# EAGLE design LM386 basic (EAGLE 6.4)
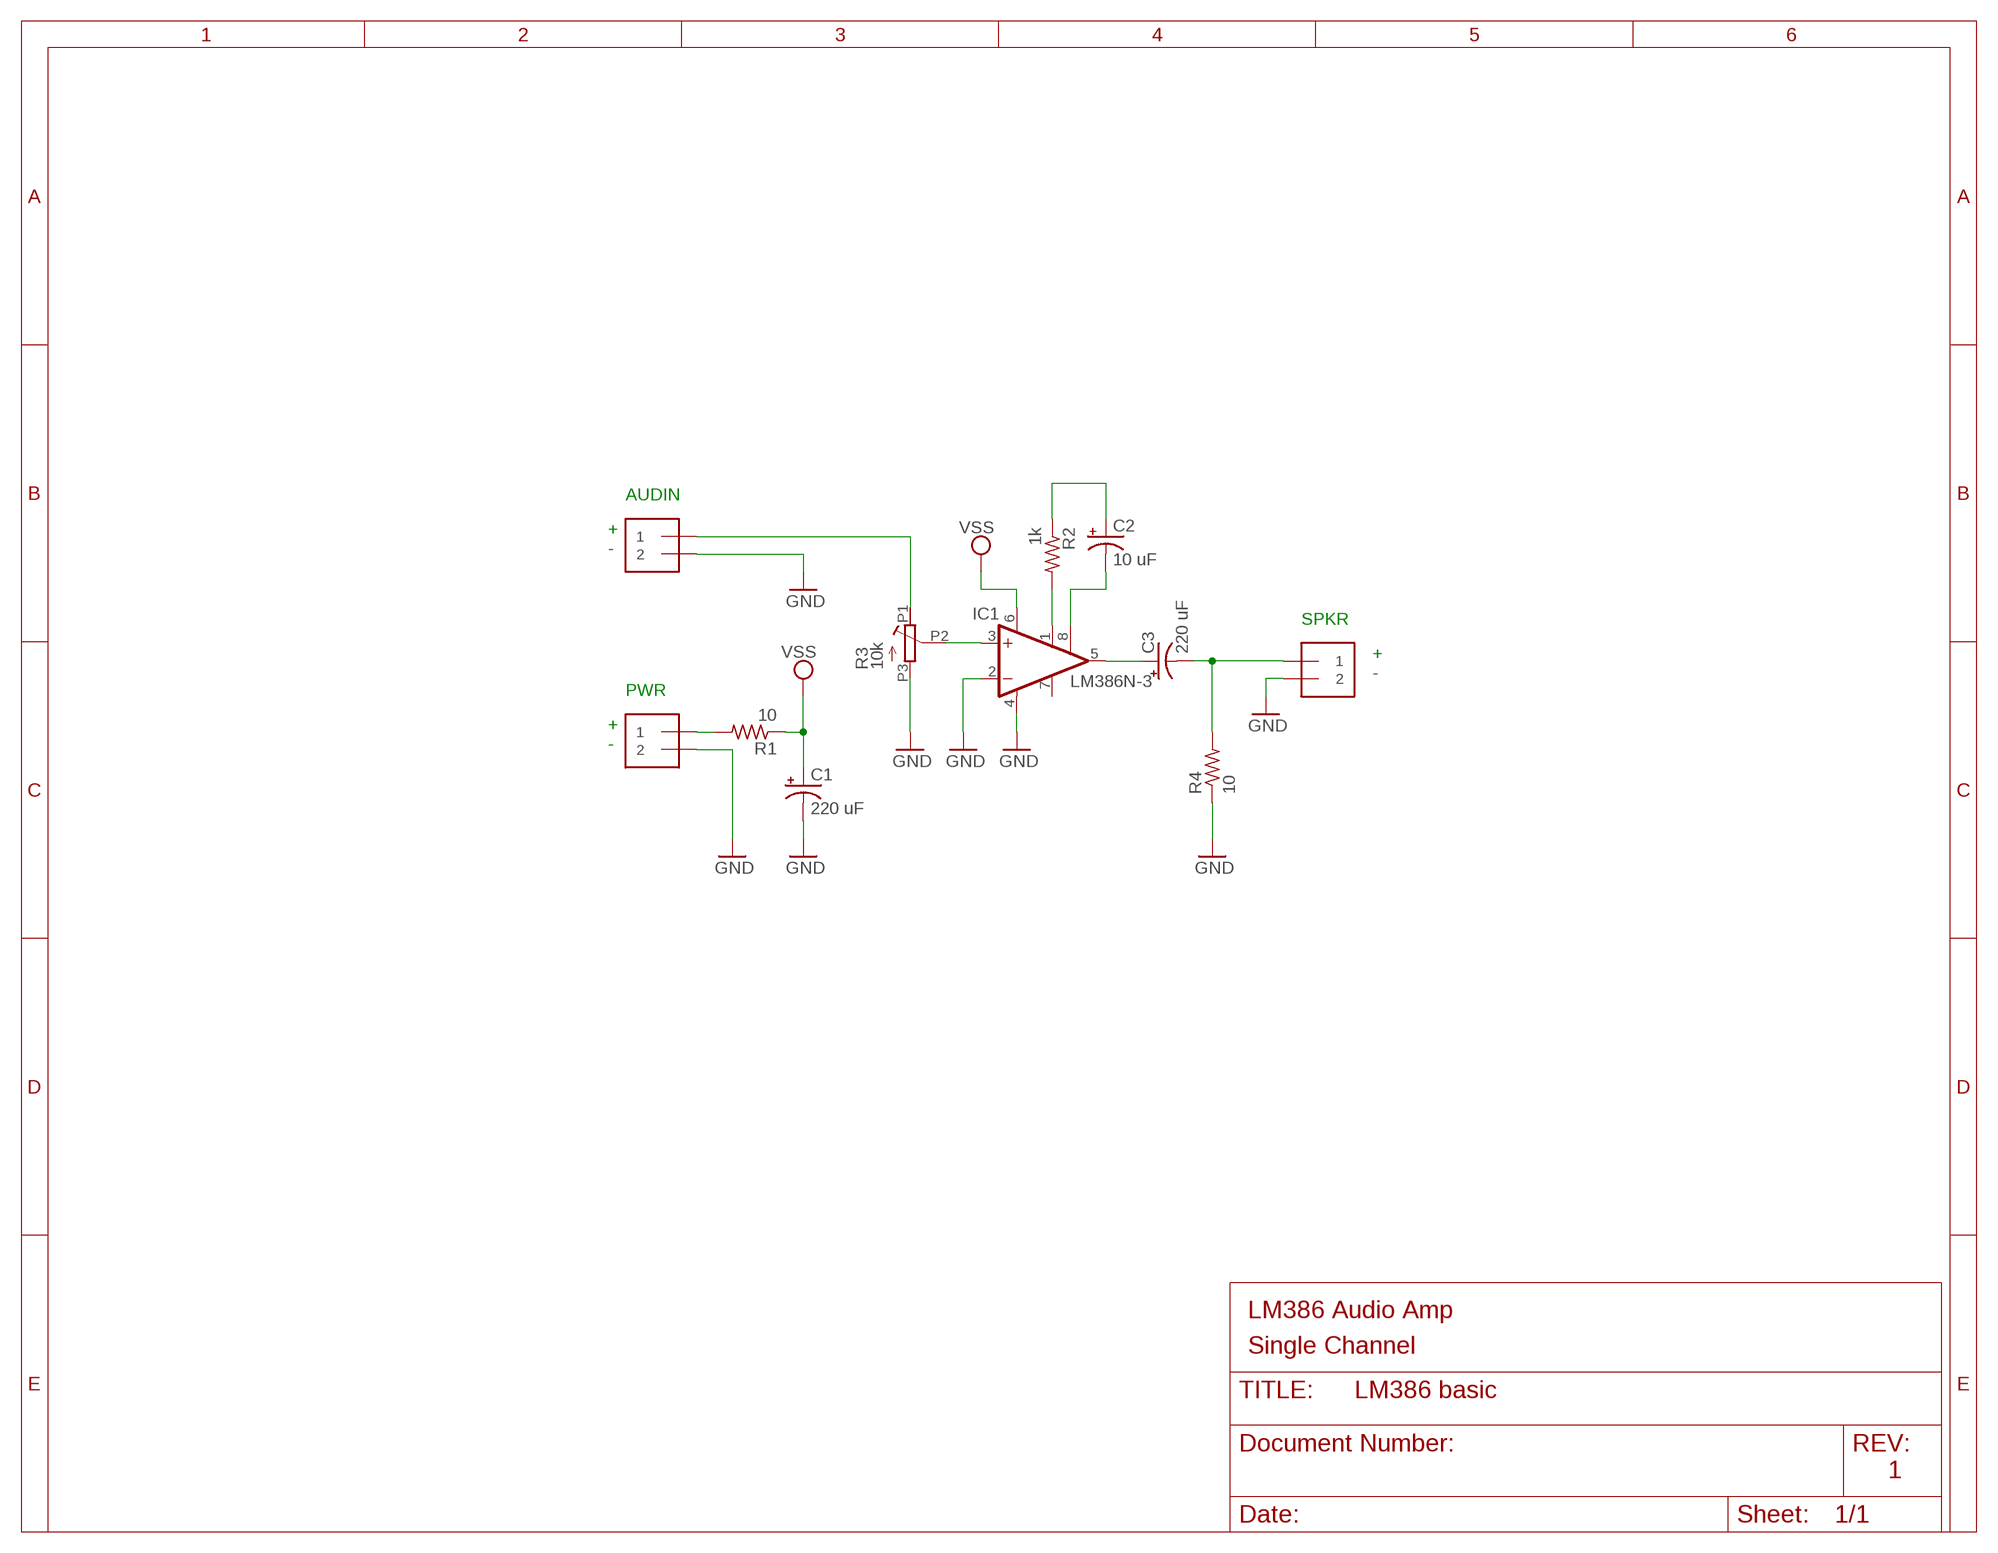
[diagram p0: schematic, sheet 1]

## Parts
AUDIN  1X2-3.5MM  [1X2-3.5MM]
C1  220 uF  CPOL-USE2.5-6  [E2,5-6]
C2  10 uF  CPOL-USE2-5  [E2-5]
C3  220 uF  CPOL-USE2.5-6  [E2,5-6]
IC1  LM386N-3  [DIL08]
PWR  1X2-3.5MM  [1X2-3.5MM]
R1  10  R-US_0309/12  [0309/12]
R2  1k  R-US_0309/12  [0309/12]
R3  10k  TRIMPOT  [POT-THRU-01]
R4  10  R-US_0309/12  [0309/12]
SPKR  1X2-3.5MM  [1X2-3.5MM]

## Nets
GND: AUDIN.2 C1.- IC1.2(-IN) IC1.4(GND) PWR.2 R3.P3(A) R4.1 SPKR.2
N$1: AUDIN.1 R3.P1(E)
N$2: C3.+ IC1.5(OUT)
N$3: IC1.1(GAIN) R2.2
N$4: C3.- R4.2 SPKR.1
N$5: IC1.3(+IN) R3.P2(S)
N$6: PWR.1 R1.2
N$7: C2.+ R2.1
N$8: C2.- IC1.8(GAIN)
VSS: C1.+ IC1.6(VS) R1.1
Unconnected: IC1.7(BYPASS)

## Notes on the sheet
- AUDIN
- +
  -
- SPKR
- +
  -
- PWR
- +
  -
- LM386 Audio Amp
- Single Channel
- 1

## Library data of the parts
AUDIN PWR SPKR = methuzla:1X2: 3.5mm Terminal block http://www.ladyada.net/library/pcb/eaglelibrary.html
C1 C3 = methuzla:CPOL-US: POLARIZED CAPACITOR, American symbol
C2 = rcl:CPOL-US: POLARIZED CAPACITOR, American symbol
IC1 = linear:LM386?-*: Low Voltage Audio Power Amplifier Source: http://cache.national.com/ds/LM/LM386.pdf
R1 R2 R4 = rcl:R-US_: RESISTOR, American symbol
R3 = methuzla:TRIMPOT: 3/8" square trimpot with 0.01" thru hole spacing

## Net classes
0 default: width 0.508 mm, drill 0.508 mm, clearance 0.305 mm

## Board
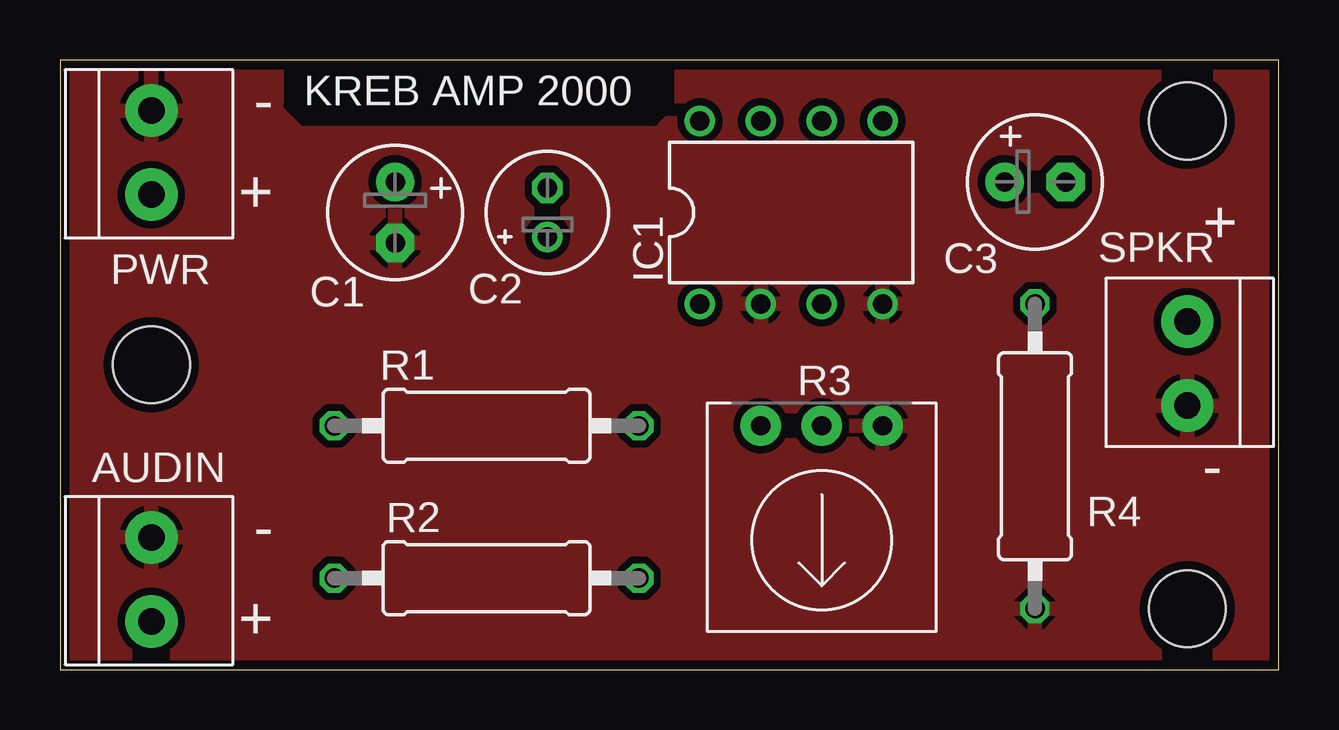
[diagram p1: board, top side]
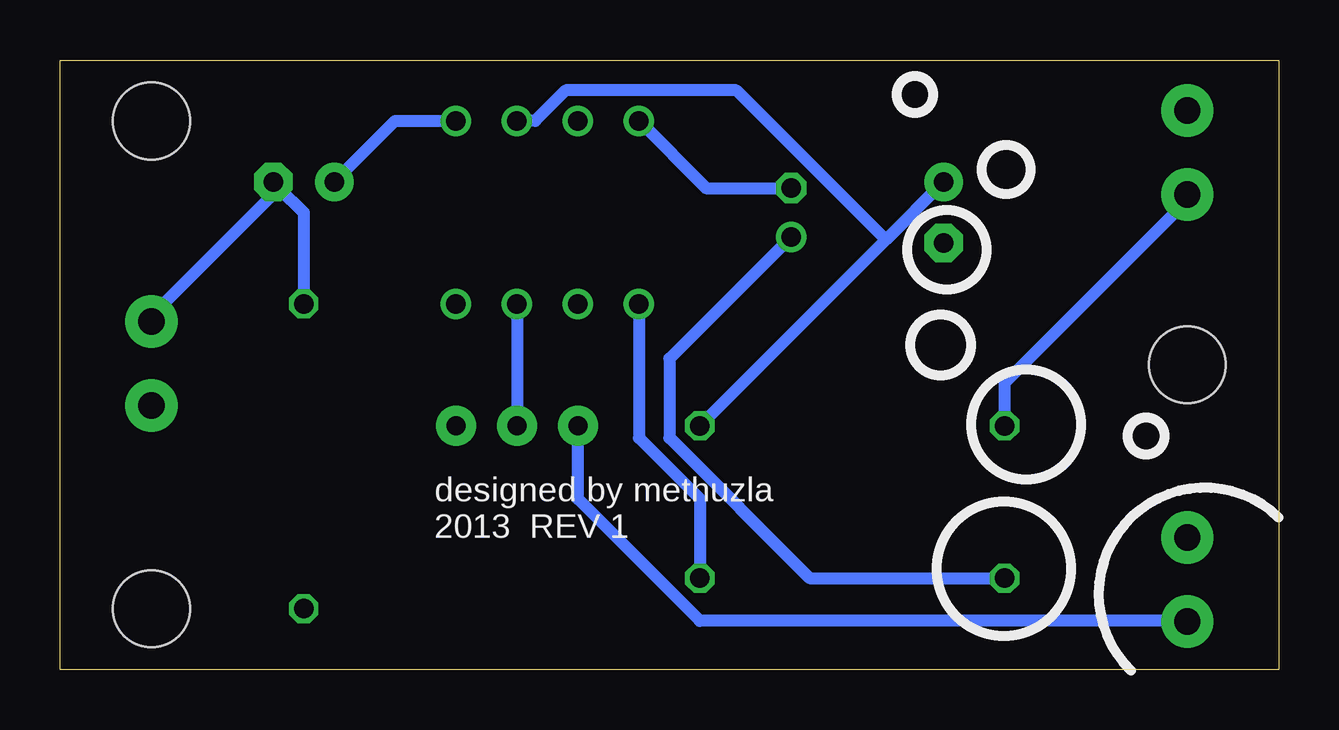
[diagram p2: board, bottom side, seen from below]

Size 50.8 x 25.4 mm. Coordinates in mm from the lower left corner, seen from the top.
Outline: 0,0 50.8,0 50.8,25.4 0,25.4 0,0
Copper layers (1*16): Top 0.0356mm / dielectric 1.5011mm / Bottom 0.0356mm
Design rules "LaenPCBOrder": minimum track width 6mil, minimum drill 13mil, track to track 6mil, track to pad 6mil, pad to pad 6mil, via to via 6mil, smd to smd 6mil, copper to edge 15mil, drill to drill 6mil, minimum pad ring 7mil, minimum via ring 7mil, stop-mask expansion 4mil, vias tented up to drill 0mil, thermal gap 10mil
Holes 3.2 mm at 3.81,12.7 46.99,2.54 46.99,22.86
tRestrict: area 9.5,22.9 to 25.4,26

### Footprints (pad centres in the part's own frame; a part is rotated, then mirrored left to right if it is on the bottom)
1X2-3.5MM = drill 1.1 pad 2.184: 1 1.8,0; 2 -1.7,0
E2,5-6 = drill 0.813 pad 1.6: + -1.27,0 | drill 0.813 pad 1.6 octagon: - 1.27,0
E2-5 = drill 0.813 pad 1.27: + -1.016,0 | drill 0.813 pad 1.27 octagon: - 1.016,0
DIL08 = drill 0.813 pad 1.27: 1 -3.81,-3.81; 2 -1.27,-3.81; 3 1.27,-3.81; 4 3.81,-3.81; 5 3.81,3.81; 6 1.27,3.81; 7 -1.27,3.81; 8 -3.81,3.81
0309/12 = drill 0.813 octagon: 1 -6.35,0; 2 6.35,0
POT-THRU-01 = drill 0.8 pad 1.676: P1 2.54,-3.81; P2 0,-3.81; P3 -2.54,-3.81

### Placement (x,y rotation side)
AUDIN  3.81,3.81 270 top
C1  13.97,19.05 270 top
C2  20.32,19.05 90 top
C3  40.64,20.32 0 top
IC1  30.48,19.05 0 top
PWR  3.81,21.59 270 top
R1  17.78,10.16 180 top
R2  17.78,3.81 0 top
R3  31.75,6.35 180 top
R4  40.64,8.89 90 top
SPKR  46.99,12.7 90 top

### Tracks (layer width: path | path; a pad name or v marks a point on that pad's centre or on a via)
GND
  pour Top: 50.8,0 50.8,25.4 0,25.4 0,0
N$1
  Bottom 0.508: R3.P1 29.21,7.11 24.13,2.03 3.81,2.03 AUDIN.1
N$2
  Bottom 0.508: IC1.5 36.83,22.86 C3.+
N$3
  Bottom 0.508: R2.2 24.13,7.11 26.67,9.65 IC1.1
N$4
  Bottom 0.508: R4.2 40.64,19.05 41.66,20.07 | 41.66,20.07 46.99,14.73 SPKR.1 | 41.66,20.07 C3.-
N$5
  Bottom 0.508: IC1.3 R3.P2
N$6
  Bottom 0.508: R1.2 11.43,11.94 3.81,19.56 PWR.1
N$7
  Bottom 0.508: R2.1 19.56,3.81 25.4,9.65 25.4,12.95 C2.+
N$8
  Bottom 0.508: C2.- 23.88,20.07 IC1.8
VSS
  Bottom 0.508: C1.+ 16.38,17.91 | 16.38,17.91 R1.1 | IC1.6 30.99,22.86 29.72,24.13 22.61,24.13 16.38,17.91

### Text on the board
tPlace: - | KREB AMP 2000 | + | + | - | - | +
bPlace: designed by methuzla / 2013 REV 1